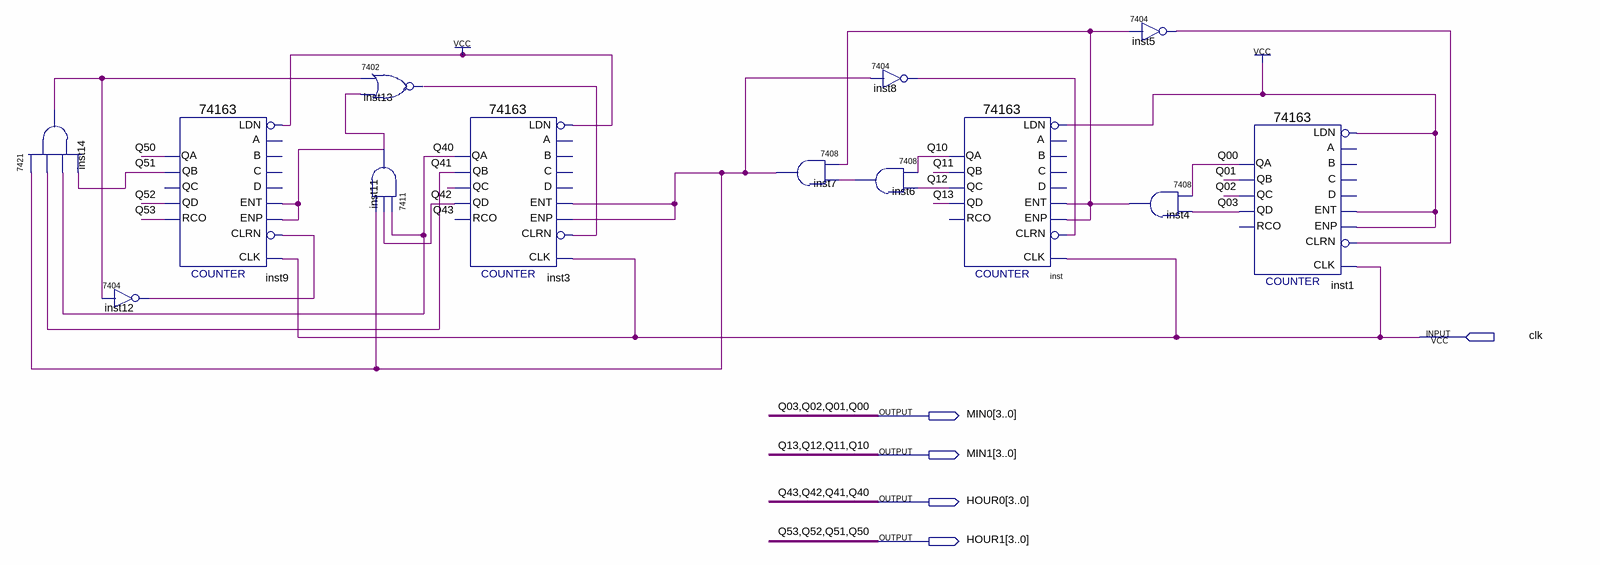
[diagram p0: schematic sheet]
// Quartus schematic timer_BLK.bdf as structural Verilog: 13 symbols, 5 pins
module timer_BLK (
  input  clk,
  output [3:0] MIN0,
  output [3:0] MIN1,
  output [3:0] HOUR0,
  output [3:0] HOUR1
);

  wire inst4_1, inst5_1, inst6_1, inst7_1, inst8_1, inst11_1, inst12_1, inst13_1, inst14_1;

  \7421  inst14 (.\5 (HOUR1[1]), .\4 (HOUR0[0]), .\3 (HOUR0[1]), .\2 (inst7_1), .\1 (inst14_1));
  \7404  inst12 (.\2 (inst14_1), .\1 (inst12_1));
  \74163  inst9 (
    .ENT(inst11_1), .CLRN(inst12_1), .CLK(clk), .ENP(inst11_1), .LDN(1'b1), .QA(HOUR1[0]), .QB(HOUR1[1]),
    .QD(HOUR1[2]), .RCO(HOUR1[3]));  // open: C, B, A, D, QC
  \7402  inst13 (.\2 (inst14_1), .\3 (inst11_1), .\1 (inst13_1));
  \7411  inst11 (.\2 (HOUR0[0]), .\3 (HOUR0[3]), .\4 (inst7_1), .\1 (inst11_1));
  \74163  inst3 (
    .ENT(inst7_1), .CLRN(inst13_1), .CLK(clk), .ENP(inst7_1), .LDN(1'b1), .QA(HOUR0[0]), .QB(HOUR0[1]),
    .QC(HOUR0[2]), .QD(HOUR0[3]));  // open: C, B, A, D, RCO
  \7408  inst7 (.\3 (inst6_1), .\2 (inst4_1), .\1 (inst7_1));
  \7404  inst8 (.\2 (inst7_1), .\1 (inst8_1));
  \7408  inst6 (.\3 (MIN1[2]), .\2 (MIN1[0]), .\1 (inst6_1));
  \74163  inst (
    .ENT(inst4_1), .CLRN(inst8_1), .CLK(clk), .ENP(inst4_1), .LDN(1'b1), .QA(MIN1[0]), .QB(MIN1[1]),
    .QC(MIN1[2]), .QD(MIN1[3]));  // open: C, B, A, D, RCO
  \7404  inst5 (.\2 (inst4_1), .\1 (inst5_1));
  \7408  inst4 (.\3 (MIN0[3]), .\2 (MIN0[0]), .\1 (inst4_1));
  \74163  inst1 (
    .ENT(1'b1), .CLRN(inst5_1), .CLK(clk), .ENP(1'b1), .LDN(1'b1), .QA(MIN0[0]), .QB(MIN0[1]), .QC(MIN0[2]),
    .QD(MIN0[3]));  // open: C, B, A, D, RCO

  // Other names for the same wires on the sheet: Q00 = MIN0[0]; Q01 = MIN0[1]; Q02 = MIN0[2]; Q03 = MIN0[3];
  //   Q10 = MIN1[0]; Q11 = MIN1[1]; Q12 = MIN1[2]; Q13 = MIN1[3]; Q40 = HOUR0[0]; Q41 = HOUR0[1]; Q42 = HOUR0[2];
  //   Q43 = HOUR0[3]; Q50 = HOUR1[0]; Q51 = HOUR1[1]; Q52 = HOUR1[2]; Q53 = HOUR1[3]
endmodule
